# Altium schematic sheet I_Sensing.SchDoc
size Letter; SheetNumber: 13; SheetTotal: 13
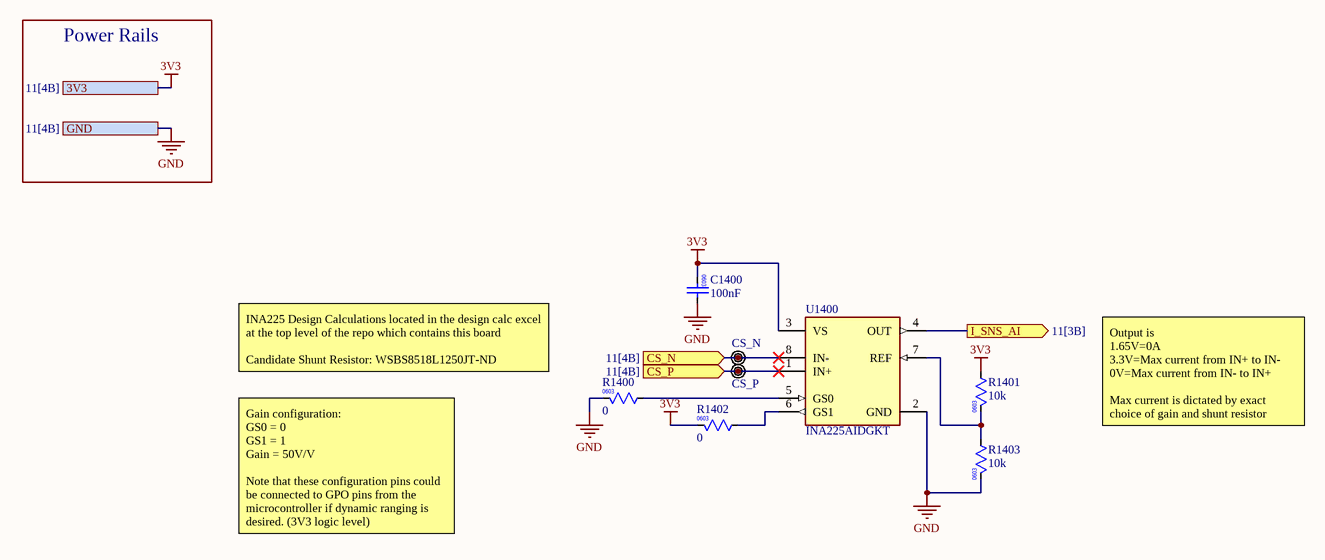
[diagram p0: I_Sensing.SchDoc]

## Parts
C1400  value 100nF  [0603 Capacitor Footprint]  (hidden comment: 0603 0.1uF 5% 50V)
R1400  value 0  [RESC0603(1608)_L]  (hidden comment: Jumper 0603)
R1401  value 10k  [0603 Resistor Footprint]  (hidden comment: 0603 10k 1% 0.3W)
R1402  value 0  [RESC0603(1608)_L]  (hidden comment: Jumper 0603)
R1403  value 10k  [0603 Resistor Footprint]  (hidden comment: 0603 10k 1% 0.3W)
TP1400  CS_N  [TESTPOINT]  (no BOM)
TP1401  CS_P  [TESTPOINT]  (no BOM)
U1400  INA225AIDGKT  [FP-INA225AIDGKT-MFG]

## Ports
3V3 (see 11[4B]), CS_N (in, see 11[4B]), CS_P (in, see 11[4B]), GND (see 11[4B]), I_SNS_AI (out, see 11[3B])

## Nets
3V3: C1400.2 R1401.1 R1402.2 U1400.3(VS) ; port 3V3
GND: C1400.1 R1400.2 R1403.2 U1400.2(GND) ; port GND
CS_N: TP1400.1(TP) U1400.8(IN-) ; port CS_N
CS_P: TP1401.1(TP) U1400.1(IN+) ; port CS_P
I_SNS_AI: U1400.4(OUT) ; port I_SNS_AI
NetR1400_1: R1400.1 U1400.5(GS0)
NetR1401_2: R1401.2 R1403.1 U1400.7(REF)
NetR1402_1: R1402.1 U1400.6(GS1)

## Notes on the sheet
- Power Rails
- INA225 Design Calculations located in the design calc excel at the top level of the repo which contains this board
  Candidate Shunt Resistor: WSBS8518L1250JT-ND
- Output is
  1.65V=0A
  3.3V=Max current from IN+ to IN-
  0V=Max current from IN- to IN+
  Max current is dictated by exact choice of gain and shunt resistor
- Gain configuration:
  GS0 = 0
  GS1 = 1
  Gain = 50V/V
  Note that these configuration pins could be connected to GPO pins from the microcontroller if dynamic ranging is desired. (3V3 logic level)

## Library data of the parts
C1400 = CMP-001-00091-5: CAP CER 0.1UF 50V X7R 0603; Manufacturer Part Number: CC0603JPX7R9BB104; Capacitor Type: Ceramic; Case/Package: 0603; Tolerance: 5%; Mounting Technology: SF; Voltage Rating: 50V
R1400 R1402 = CMP-009-00175-6: Pins: 2; Case/Package: 0603; Max Operating Temperature: 155°C; Min Operating Temperature: -55°C
R1401 R1403 = CMP-009-00181-10: RES SMD 10K OHM 1% 1/3W 0603; Manufacturer Part Number: CRCW060310K0FKEAHP; Power: 333mW; Pins: 2; Tolerance: 1%; Max Operating Temperature: 155°C; RoHS Compliant: Yes; Min Operating Temperature: -55°C; Mounting Technology: Surface Mount; Case/Package: 0603; Digikey Part Number: 541-10.0KSCT-ND
TP1400 TP1401 = CMP-020-0000-4: Source: UBC Formula Electric.SchLib; Design Item ID: Thru-Hole Test Point
U1400 = CMP-04895-000038-1: IC MONITOR PWR/CUR BIDIR 8VSSOP; Manufacturer: Texas Instruments; Nominal Supply Current: 300uA; Input Bias Current: 72uA; Bandwidth: 250kHz; Number Of Channels: 1; Voltage Gain: 0.025/0.05/0.1/0.2V/mV; Standoff Height: 0.05mm; Min Supply Voltage: 2.7V; Input Offset Voltage: 0.075mV; Max Junction Temp: +150°C; Max Supply Voltage: 36V; Ipc Land Pattern Name: SOIC65P490X110-8; Device Class L2: Linear ICs; Automotive: No; Ambient Temperature Range Low: -40°C; Octopart: https://octopart.com/ina225aidgkt-texas+instruments-28946314; Ambient Temperature Range High: +125°C; RoHS: TRUE; Height: 1.1mm; Temperature Range High: +125°C; Package: VSSOP8; Temperature Range Low: -40°C; Temperature: -40°C to +125°C; Lead Free: Yes; Digikey Description: IC MONITOR PWR/CUR BIDIR 8VSSOP; Device Class L1: Integrated Circuits (ICs); Mouser Description: Current Sense Amplifiers 36V Bidir 0-Drift Ser Crnt-Shunt Mon; Device Class L3: Instrumentation; Manufacturer Part Number: INA225AIDGKT; Category: IC; ComponentLink2Description: Datasheet; ComponentLink2URL: http://www.ti.com/lit/ds/symlink/ina225.pdf